# Altium schematic sheet Audio.SchDoc
size A3; SheetNumber: 2; SheetTotal: 6
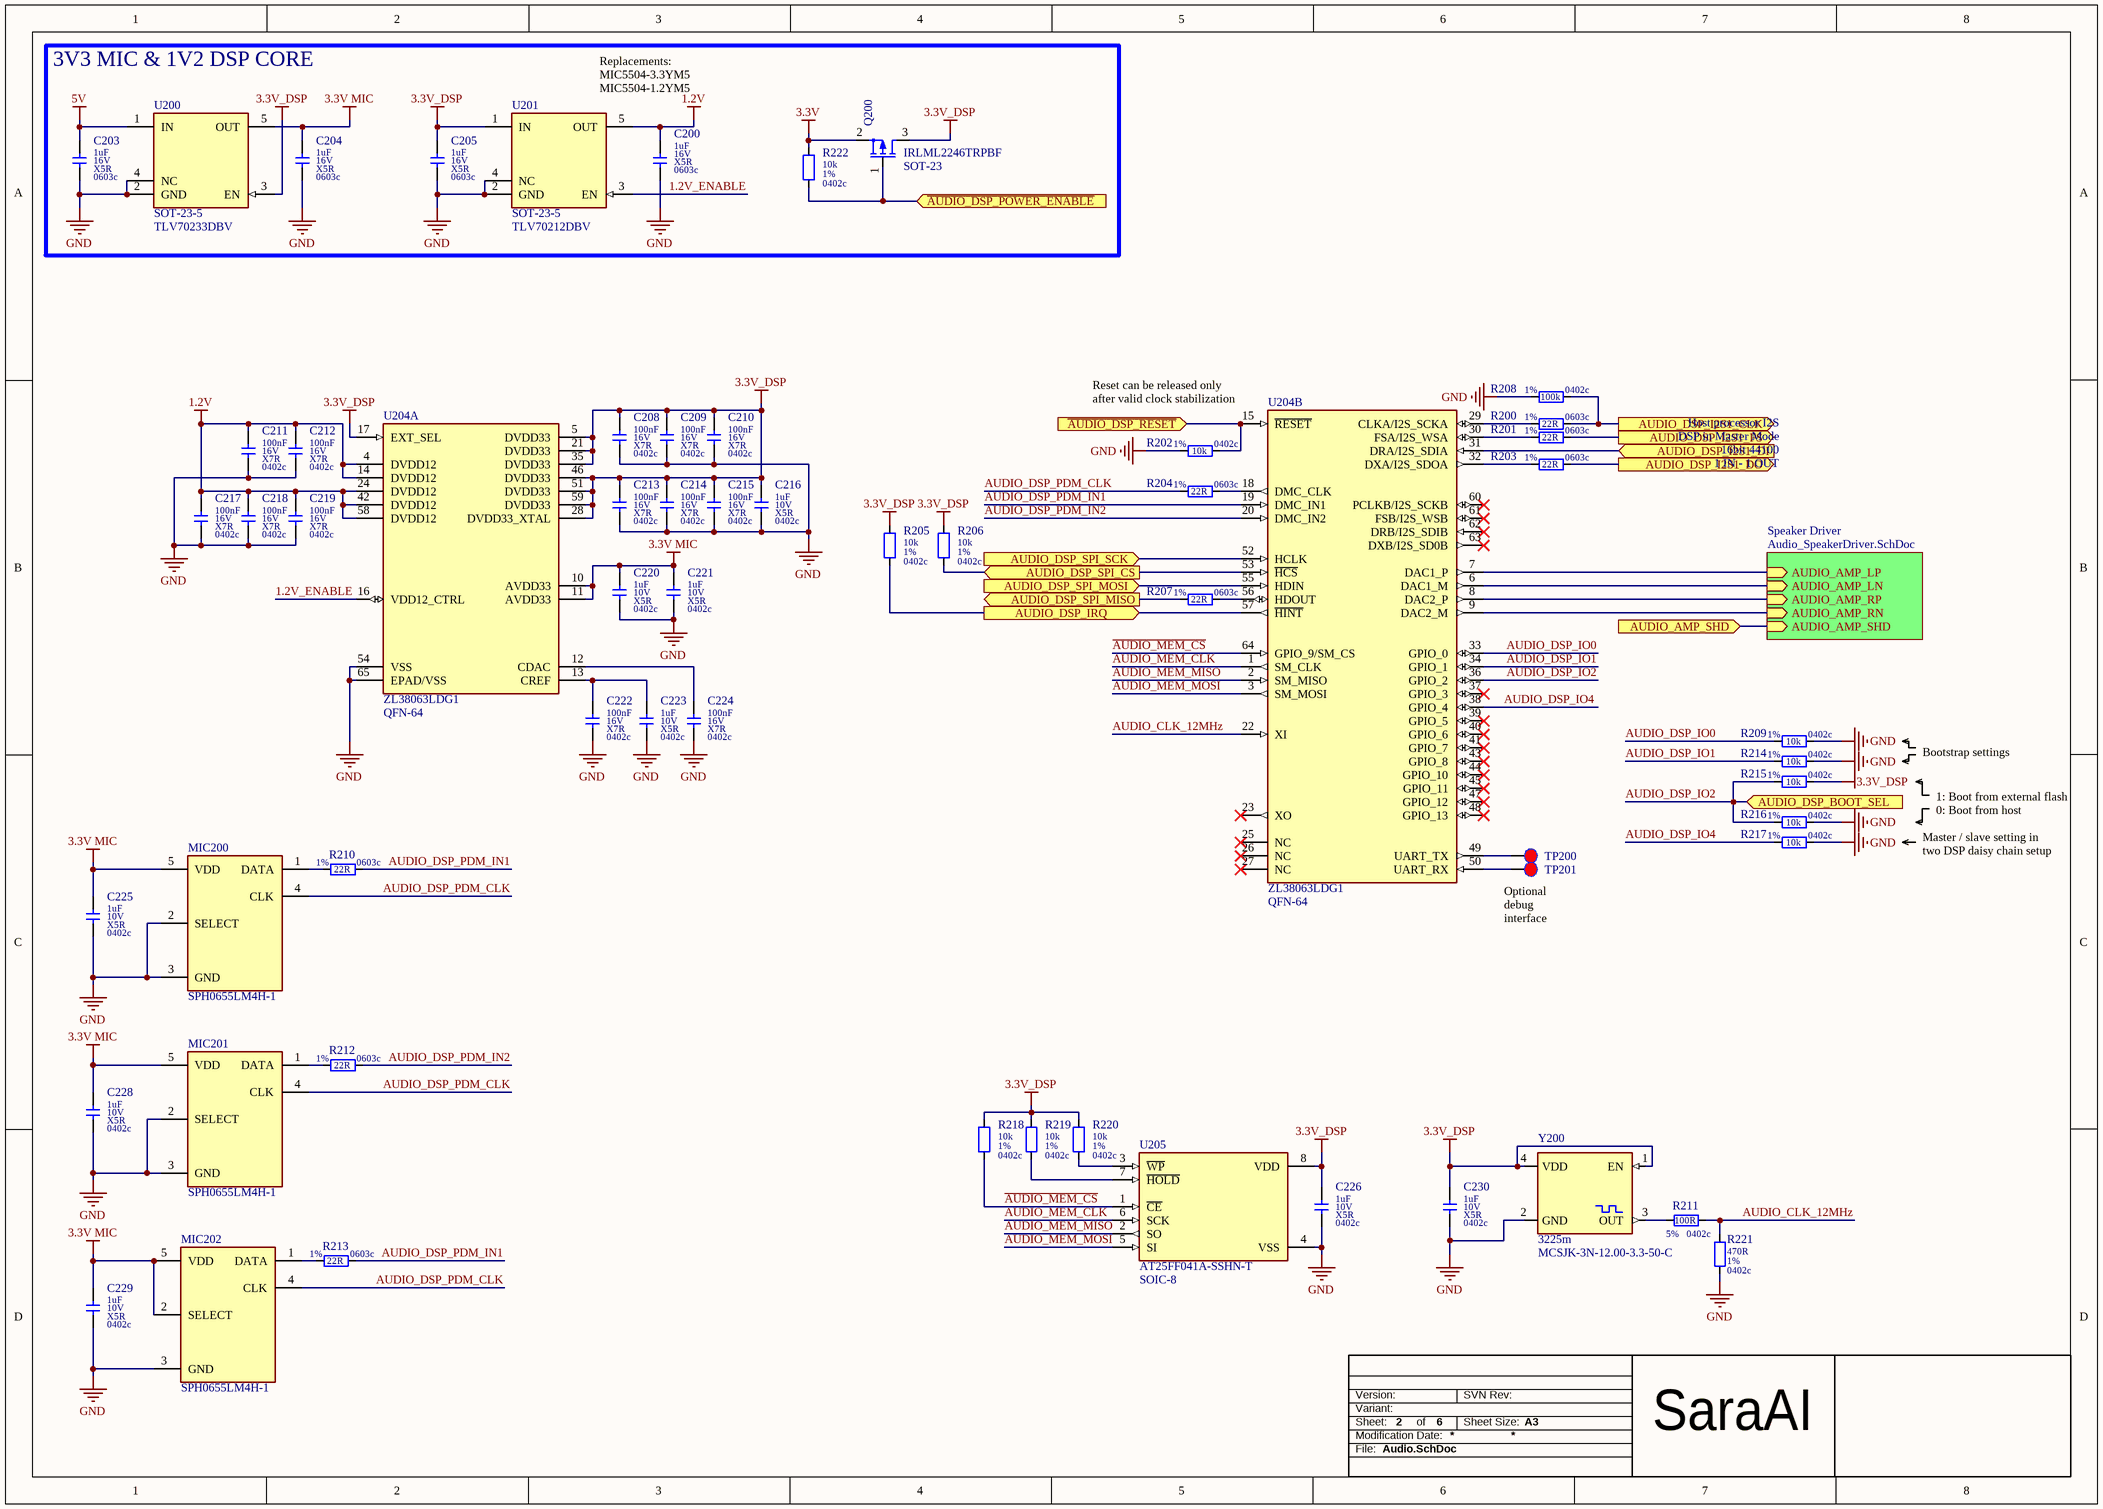
[diagram p0: Audio.SchDoc]

## Parts
C200  11 Parameter 4: X5R  07 Package: 0603c  08 Parameter 1: 1uF  09 Parameter 2: 16V  [CAPC1608X90L]  (hidden comment: CL10A105KO8NNNC)
C203  11 Parameter 4: X5R  07 Package: 0603c  08 Parameter 1: 1uF  09 Parameter 2: 16V  [CAPC1608X90L]  (hidden comment: CL10A105KO8NNNC)
C204  11 Parameter 4: X5R  07 Package: 0603c  08 Parameter 1: 1uF  09 Parameter 2: 16V  [CAPC1608X90L]  (hidden comment: CL10A105KO8NNNC)
C205  11 Parameter 4: X5R  07 Package: 0603c  08 Parameter 1: 1uF  09 Parameter 2: 16V  [CAPC1608X90L]  (hidden comment: CL10A105KO8NNNC)
C208  11 Parameter 4: X7R  07 Package: 0402c  08 Parameter 1: 100nF  09 Parameter 2: 16V  [CAPC1005X60L]  (hidden comment: CL05B104KO5NNNC)
C209  11 Parameter 4: X7R  07 Package: 0402c  08 Parameter 1: 100nF  09 Parameter 2: 16V  [CAPC1005X60L]  (hidden comment: CL05B104KO5NNNC)
C210  11 Parameter 4: X7R  07 Package: 0402c  08 Parameter 1: 100nF  09 Parameter 2: 16V  [CAPC1005X60L]  (hidden comment: CL05B104KO5NNNC)
C211  11 Parameter 4: X7R  07 Package: 0402c  08 Parameter 1: 100nF  09 Parameter 2: 16V  [CAPC1005X60L]  (hidden comment: CL05B104KO5NNNC)
C212  11 Parameter 4: X7R  07 Package: 0402c  08 Parameter 1: 100nF  09 Parameter 2: 16V  [CAPC1005X60L]  (hidden comment: CL05B104KO5NNNC)
C213  11 Parameter 4: X7R  07 Package: 0402c  08 Parameter 1: 100nF  09 Parameter 2: 16V  [CAPC1005X60L]  (hidden comment: CL05B104KO5NNNC)
C214  11 Parameter 4: X7R  07 Package: 0402c  08 Parameter 1: 100nF  09 Parameter 2: 16V  [CAPC1005X60L]  (hidden comment: CL05B104KO5NNNC)
C215  11 Parameter 4: X7R  07 Package: 0402c  08 Parameter 1: 100nF  09 Parameter 2: 16V  [CAPC1005X60L]  (hidden comment: CL05B104KO5NNNC)
C216  11 Parameter 4: X5R  07 Package: 0402c  08 Parameter 1: 1uF  09 Parameter 2: 10V  [CAPC1005X60L]  (hidden comment: CL05A105KP5NNNC)
C217  11 Parameter 4: X7R  07 Package: 0402c  08 Parameter 1: 100nF  09 Parameter 2: 16V  [CAPC1005X60L]  (hidden comment: CL05B104KO5NNNC)
C218  11 Parameter 4: X7R  07 Package: 0402c  08 Parameter 1: 100nF  09 Parameter 2: 16V  [CAPC1005X60L]  (hidden comment: CL05B104KO5NNNC)
C219  11 Parameter 4: X7R  07 Package: 0402c  08 Parameter 1: 100nF  09 Parameter 2: 16V  [CAPC1005X60L]  (hidden comment: CL05B104KO5NNNC)
C220  11 Parameter 4: X5R  07 Package: 0402c  08 Parameter 1: 1uF  09 Parameter 2: 10V  [CAPC1005X60L]  (hidden comment: CL05A105KP5NNNC)
C221  11 Parameter 4: X5R  07 Package: 0402c  08 Parameter 1: 1uF  09 Parameter 2: 10V  [CAPC1005X60L]  (hidden comment: CL05A105KP5NNNC)
C222  11 Parameter 4: X7R  07 Package: 0402c  08 Parameter 1: 100nF  09 Parameter 2: 16V  [CAPC1005X60L]  (hidden comment: CL05B104KO5NNNC)
C223  11 Parameter 4: X5R  07 Package: 0402c  08 Parameter 1: 1uF  09 Parameter 2: 10V  [CAPC1005X60L]  (hidden comment: CL05A105KP5NNNC)
C224  11 Parameter 4: X7R  07 Package: 0402c  08 Parameter 1: 100nF  09 Parameter 2: 16V  [CAPC1005X60L]  (hidden comment: CL05B104KO5NNNC)
C225  11 Parameter 4: X5R  07 Package: 0402c  08 Parameter 1: 1uF  09 Parameter 2: 10V  [CAPC1005X60L]  (hidden comment: CL05A105KP5NNNC)
C226  11 Parameter 4: X5R  07 Package: 0402c  08 Parameter 1: 1uF  09 Parameter 2: 10V  [CAPC1005X60L]  (hidden comment: CL05A105KP5NNNC)
C228  11 Parameter 4: X5R  07 Package: 0402c  08 Parameter 1: 1uF  09 Parameter 2: 10V  [CAPC1005X60L]  (hidden comment: CL05A105KP5NNNC)
C229  11 Parameter 4: X5R  07 Package: 0402c  08 Parameter 1: 1uF  09 Parameter 2: 10V  [CAPC1005X60L]  (hidden comment: CL05A105KP5NNNC)
C230  11 Parameter 4: X5R  07 Package: 0402c  08 Parameter 1: 1uF  09 Parameter 2: 10V  [CAPC1005X60L]  (hidden comment: CL05A105KP5NNNC)
MIC200  SPH0655LM4H-1  [KNOWLES SPH0655LM4H-1]
MIC201  SPH0655LM4H-1  [KNOWLES SPH0655LM4H-1]
MIC202  SPH0655LM4H-1  [KNOWLES SPH0655LM4H-1]
Q200  07 Package: SOT-23  [SOT95P240X110-3L]  (hidden comment: IRLML2246TRPBF)
R200  07 Package: 0603c  09 Parameter 2: 1%  08 Parameter 1: 22R  [RESC1608X55L]  (hidden comment: RC0603FR-0722RL)
R201  07 Package: 0603c  09 Parameter 2: 1%  08 Parameter 1: 22R  [RESC1608X55L]  (hidden comment: RC0603FR-0722RL)
R202  07 Package: 0402c  09 Parameter 2: 1%  08 Parameter 1: 10k  [RESC1005X40L]  (hidden comment: RC0402FR-0710KL)
R203  07 Package: 0603c  09 Parameter 2: 1%  08 Parameter 1: 22R  [RESC1608X55L]  (hidden comment: RC0603FR-0722RL)
R204  07 Package: 0603c  09 Parameter 2: 1%  08 Parameter 1: 22R  [RESC1608X55L]  (hidden comment: RC0603FR-0722RL)
R205  07 Package: 0402c  09 Parameter 2: 1%  08 Parameter 1: 10k  [RESC1005X40L]  (hidden comment: RC0402FR-0710KL)
R206  07 Package: 0402c  09 Parameter 2: 1%  08 Parameter 1: 10k  [RESC1005X40L]  (hidden comment: RC0402FR-0710KL)
R207  07 Package: 0603c  09 Parameter 2: 1%  08 Parameter 1: 22R  [RESC1608X55L]  (hidden comment: RC0603FR-0722RL)
R208  07 Package: 0402c  09 Parameter 2: 1%  08 Parameter 1: 100k  [RESC1005X40L]  (hidden comment: RC0402FR-07100KL)
R209  07 Package: 0402c  09 Parameter 2: 1%  08 Parameter 1: 10k  [RESC1005X40L]  (hidden comment: RC0402FR-0710KL)
R210  07 Package: 0603c  09 Parameter 2: 1%  08 Parameter 1: 22R  [RESC1608X55L]  (hidden comment: RC0603FR-0722RL)
R211  07 Package: 0402c  09 Parameter 2: 5%  08 Parameter 1: 100R  [RESC1005X40L]  (hidden comment: 0402WGJ0101TCE)
R212  07 Package: 0603c  09 Parameter 2: 1%  08 Parameter 1: 22R  [RESC1608X55L]  (hidden comment: RC0603FR-0722RL)
R213  07 Package: 0603c  09 Parameter 2: 1%  08 Parameter 1: 22R  [RESC1608X55L]  (hidden comment: RC0603FR-0722RL)
R214  07 Package: 0402c  09 Parameter 2: 1%  08 Parameter 1: 10k  [RESC1005X40L]  (hidden comment: RC0402FR-0710KL)
R215  07 Package: 0402c  09 Parameter 2: 1%  08 Parameter 1: 10k  [RESC1005X40L]  (hidden comment: RC0402FR-0710KL)
R216  07 Package: 0402c  09 Parameter 2: 1%  08 Parameter 1: 10k  [RESC1005X40L]  (hidden comment: RC0402FR-0710KL)
R217  07 Package: 0402c  09 Parameter 2: 1%  08 Parameter 1: 10k  [RESC1005X40L]  (hidden comment: RC0402FR-0710KL)
R218  07 Package: 0402c  09 Parameter 2: 1%  08 Parameter 1: 10k  [RESC1005X40L]  (hidden comment: RC0402FR-0710KL)
R219  07 Package: 0402c  09 Parameter 2: 1%  08 Parameter 1: 10k  [RESC1005X40L]  (hidden comment: RC0402FR-0710KL)
R220  07 Package: 0402c  09 Parameter 2: 1%  08 Parameter 1: 10k  [RESC1005X40L]  (hidden comment: RC0402FR-0710KL)
R221  07 Package: 0402c  09 Parameter 2: 1%  08 Parameter 1: 470R  [RESC1005X40L]  (hidden comment: RC0402FR-07470RL)
R222  07 Package: 0402c  09 Parameter 2: 1%  08 Parameter 1: 10k  [RESC1005X40L]  (hidden comment: RC0402FR-0710KL)
TP200  TESTPAD  [TP 1.2mm]  (value not drawn)  (no BOM)
TP201  TESTPAD  [TP 1.2mm]  (value not drawn)  (no BOM)
U200  07 Package: SOT-23-5  [SOT95P280X145-5L]  (hidden comment: TLV70233DBV)
U201  07 Package: SOT-23-5  [SOT95P280X145-5L]  (hidden comment: TLV70212DBV)
U204  07 Package: QFN-64  [QFN50P900X900X100_HS-65L]  (hidden comment: ZL38063LDG1)  (parts A,B of 2)
U205  07 Package: SOIC-8  [SOIC127P600X175-8L]  (hidden comment: AT25FF041A-SSHN-T)
Y200  07 Package: 3225m  [OSCCC320X250X100L]  (hidden comment: MCSJK-3N-12.00-3.3-50-C)

## Blocks framed on the sheet
3V3 MIC & 1V2 DSP CORE: C200 C203-C205 Q200 R222 U200 U201

## Sub-sheets
Speaker Driver = Audio_SpeakerDriver.SchDoc: AUDIO_AMP_LN (in), AUDIO_AMP_SHD (in), AUDIO_AMP_RN (in), AUDIO_AMP_RP (in), AUDIO_AMP_LP (in)

## Ports
AUDIO_AMP_SHD (in), AUDIO_DSP_BOOT_SEL (in), AUDIO_DSP_I2S1_CLK (out), AUDIO_DSP_I2S1_DI (in), AUDIO_DSP_I2S1_DO (out), AUDIO_DSP_I2S1_FS (out), AUDIO_DSP_IRQ (out), AUDIO_DSP_SPI_CS (in), AUDIO_DSP_SPI_MISO (out), AUDIO_DSP_SPI_MOSI (in), AUDIO_DSP_SPI_SCK (in), ~{AUDIO_DSP_POWER_ENABLE} (in), ~{AUDIO_DSP_RESET} (in)

## Nets
1.2V: C200.2 C211.2 C212.2 C217.2 C218.2 C219.2 U201.5(OUT) U204.4(DVDD12) U204.14(DVDD12) U204.24(DVDD12) U204.42(DVDD12) U204.58(DVDD12)
3.3V: Q200.2(S) R222.2
3.3V MIC: C204.2 C220.2 C221.2 C225.2 C228.2 C229.2 MIC200.5(VDD) MIC201.5(VDD) MIC202.2(SELECT) MIC202.5(VDD) U200.5(OUT) U204.10(AVDD33) U204.11(AVDD33)
3.3V_DSP: C205.2 C208.2 C209.2 C210.2 C213.2 C214.2 C215.2 C216.2 C226.2 C230.2 Q200.3(D) R205.2 R206.2 R215.2 R218.2 R219.2 R220.2 U200.3(EN) U201.1(IN) U204.5(DVDD33) U204.17(EXT_SEL) U204.21(DVDD33) U204.28(DVDD33_XTAL) U204.35(DVDD33) U204.46(DVDD33) U204.51(DVDD33) U204.59(DVDD33) U205.8(VDD) Y200.1(EN) Y200.4(VDD)
5V: C203.2 U200.1(IN)
GND: C200.1 C203.1 C204.1 C205.1 C208.1 C209.1 C210.1 C211.1 C212.1 C213.1 C214.1 C215.1 C216.1 C217.1 C218.1 C219.1 C220.1 C221.1 C222.1 C223.1 C224.1 C225.1 C226.1 C228.1 C229.1 C230.1 MIC200.2(SELECT) MIC200.3(GND) MIC201.2(SELECT) MIC201.3(GND) MIC202.3(GND) R202.1 R208.1 R209.2 R214.2 R216.2 R217.2 R221.1 U200.2(GND) U200.4(NC) U201.2(GND) U201.4(NC) U204.54(VSS) U204.65(EPAD/VSS) U205.4(VSS) Y200.2(GND)
1.2V_ENABLE: U201.3(EN) U204.16(VDD12_CTRL)
~{AUDIO_DSP_POWER_ENABLE}: Q200.1(G) R222.1 ; port ~{AUDIO_DSP_POWER_ENABLE}
~{AUDIO_DSP_RESET}: R202.2 U204.15(~{RESET}) ; port ~{AUDIO_DSP_RESET}
~{AUDIO_MEM_CS}: R218.1 U204.64(GPIO_9/SM_CS) U205.1(~{CE})
AUDIO_AMP_SHD: port AUDIO_AMP_SHD, sheet Speaker Driver/AUDIO_AMP_SHD
AUDIO_CLK_12MHz: R211.2 R221.2 U204.22(XI)
AUDIO_DSP_I2S1_CLK: R200.2 R208.2 ; port AUDIO_DSP_I2S1_CLK
AUDIO_DSP_I2S1_DI: U204.31(DRA/I2S_SDIA) ; port AUDIO_DSP_I2S1_DI
AUDIO_DSP_I2S1_DO: R203.2 ; port AUDIO_DSP_I2S1_DO
AUDIO_DSP_I2S1_FS: R201.2 ; port AUDIO_DSP_I2S1_FS
AUDIO_DSP_IO0: R209.1 U204.33(GPIO_0)
AUDIO_DSP_IO1: R214.1 U204.34(GPIO_1)
AUDIO_DSP_IO2: R215.1 R216.1 U204.36(GPIO_2) ; port AUDIO_DSP_BOOT_SEL
AUDIO_DSP_IO4: R217.1 U204.38(GPIO_4)
AUDIO_DSP_IRQ: R205.1 U204.57(~{HINT}) ; port AUDIO_DSP_IRQ
AUDIO_DSP_PDM_CLK: MIC200.4(CLK) MIC201.4(CLK) MIC202.4(CLK) R204.1
AUDIO_DSP_PDM_IN1: R210.2 R213.2 U204.19(DMC_IN1)
AUDIO_DSP_PDM_IN2: R212.2 U204.20(DMC_IN2)
AUDIO_DSP_SPI_CS: R206.1 U204.53(~{HCS}) ; port AUDIO_DSP_SPI_CS
AUDIO_DSP_SPI_MISO: R207.1 ; port AUDIO_DSP_SPI_MISO
AUDIO_DSP_SPI_MOSI: U204.55(HDIN) ; port AUDIO_DSP_SPI_MOSI
AUDIO_DSP_SPI_SCK: U204.52(HCLK) ; port AUDIO_DSP_SPI_SCK
AUDIO_MEM_CLK: U204.1(SM_CLK) U205.6(SCK)
AUDIO_MEM_MISO: U204.2(SM_MISO) U205.2(SO)
AUDIO_MEM_MOSI: U204.3(SM_MOSI) U205.5(SI)
NetC222_2: C222.2 C223.2 U204.13(CREF)
NetC224_2: C224.2 U204.12(CDAC)
NetMIC200_1: MIC200.1(DATA) R210.1
NetMIC201_1: MIC201.1(DATA) R212.1
NetMIC202_1: MIC202.1(DATA) R213.1
NetR200_1: R200.1 U204.29(CLKA/I2S_SCKA)
NetR201_1: R201.1 U204.30(FSA/I2S_WSA)
NetR203_1: R203.1 U204.32(DXA/I2S_SDOA)
NetR204_2: R204.2 U204.18(DMC_CLK)
NetR207_2: R207.2 U204.56(HDOUT)
NetR211_1: R211.1 Y200.3(OUT)
NetR219_1: R219.1 U205.7(~{HOLD})
NetR220_1: R220.1 U205.3(~{WP})
NetTP200_1: TP200.1 U204.49(UART_TX)
NetTP201_1: TP201.1 U204.50(UART_RX)
NetU204_6: U204.6(DAC1_M) ; sheet Speaker Driver/AUDIO_AMP_LN
NetU204_7: U204.7(DAC1_P) ; sheet Speaker Driver/AUDIO_AMP_LP
NetU204_8: U204.8(DAC2_P) ; sheet Speaker Driver/AUDIO_AMP_RP
NetU204_9: U204.9(DAC2_M) ; sheet Speaker Driver/AUDIO_AMP_RN

Not connected (* = marked no-connect by the designer): U204 23(XO)* 25(NC)* 26(NC)* 27(NC)* 37(GPIO_3)* 39(GPIO_5)* 40(GPIO_6)* 41(GPIO_7)* 43(GPIO_8)* 44(GPIO_10)* 45(GPIO_11)* 47(GPIO_12)* 48(GPIO_13)* 60(PCLKB/I2S_SCKB)* 61(FSB/I2S_WSB)* 62(DRB/I2S_SDIB)* 63(DXB/I2S_SD0B)*

## Notes on the sheet
- (near U201) Replacements: MIC5504-3.3YM5 MIC5504-1.2YM5
- Reset can be released only after valid clock stabilization
- Host processor I2S
- 16bit 44100
- DSP in Master Mode
- 1 IN - 1 OUT
- Bootstrap settings
- Master / slave setting in two DSP daisy chain setup
- 1: Boot from external flash
  0: Boot from host
- (near TP201) Optional debug interface
- Version:
- SVN Rev:
- Sheet:
- File:
- Modification Date:
- Variant:
- of
- Sheet Size:
- A3
- SaraAI

## Library data of the parts
C200 C203-C205 = 24: SMT 0603c 1uF 16V 10% X5R 6.9MHz 85'C; 03 Manufacturer: Samsung; 00 Index: 24; 01 Name: CAPACITOR CERAMIC CL10A105KO8NNNC Samsung; 05 Sub Group: CERAMIC; 04 Main Group: CAPACITOR; 06 Assembly: SMT; 12 Parameter 5: 6.9MHz; 13 Parameter 6: 85'C; 14 Modification Date: 16.11.2020; ComponentLink1Description: DATASHEET; ComponentLink1URL: E:\Praca\Mindsailors\Mindsailors Altium\Database Library\Datasheets\CAPACITOR\Samsung CL10A105KO8NNNC.pdf; 02 MPN: CL10A105KO8NNNC; 10 Parameter 3: 10%
C208-C215 C217-C219 C222 C224 = 138: SMT 0402c 100nF 16V 10% X7R 25.8MHz 125'C; 03 Manufacturer: Samsung; 00 Index: 138; 01 Name: CAPACITOR CERAMIC CL05B104KO5NNNC Samsung; 05 Sub Group: CERAMIC; 04 Main Group: CAPACITOR; 06 Assembly: SMT; 12 Parameter 5: 25.8MHz; 13 Parameter 6: 125'C; 14 Modification Date: 16.11.2020; ComponentLink1Description: DATASHEET; ComponentLink1URL: E:\Praca\Mindsailors\Mindsailors Altium\Database Library\Datasheets\CAPACITOR\Samsung CL05B104KO5NNNC.pdf; 02 MPN: CL05B104KO5NNNC; 10 Parameter 3: 10%
C216 C220 C221 C223 C225 C226 C228-C230 = 154: SMT 0402c 1uF 10V 10% X5R 10.2MHz 85'C; 03 Manufacturer: Samsung; 00 Index: 154; 01 Name: CAPACITOR THICK FILM CL05A105KP5NNNC Samsung; 05 Sub Group: THICK FILM; 04 Main Group: CAPACITOR; 06 Assembly: SMT; 12 Parameter 5: 10.2MHz; 13 Parameter 6: 85'C; 14 Modification Date: 16.11.2020; ComponentLink1Description: DATASHEET; ComponentLink1URL: E:\Praca\Mindsailors\Mindsailors Altium\Database Library\Datasheets\CAPACITOR\Samsung CL05A105KP5NNNC.pdf; 02 MPN: CL05A105KP5NNNC; 10 Parameter 3: 10%
MIC200-MIC202 = 494: SMT -37dBFS 1.65V - 3.6V 25Hz - 22kHz Omnidirectional; 03 Manufacturer: Knowles; 00 Index: 494; 01 Name: ACOUSTIC MICROPHONE SPH0655LM4H-1 Knowles; 04 Main Group: ACOUSTIC; 05 Sub Group: MICROPHONE; 06 Assembly: SMT; 11 Parameter 4: 25Hz - 22kHz; 13 Parameter 6: Omnidirectional; 14 Modification Date: 08.03.2021; ComponentLink1Description: DATASHEET; ComponentLink1URL: https://www.knowles.com/docs/default-source/default-document-library/sph0655lm4h-1_cornell_ii_datasheet_1.pdf?Status=Master&sfvrsn=663271b1_0; 09 Parameter 2: -37dBFS; 10 Parameter 3: 1.65V - 3.6V; 02 MPN: SPH0655LM4H-1; 07 Package: *
Q200 = 42: SMT SOT-23 P-MOS -20V -2.6A 1.3W; 03 Manufacturer: International Rectifier; 00 Index: 42; 01 Name: TRANSISTOR MOSFET IRLML2246TRPBF International Rectifier; 04 Main Group: TRANSISTOR; 05 Sub Group: MOSFET; Library Directory: sym_basics/; Fotprint Directory: fot_ipc/; 06 Assembly: SMT; 13 Parameter 6: 1.3W; 14 Modification Date: 16.11.2020; ComponentLink1Description: DATASHEET; ComponentLink1URL: E:\Praca\Mindsailors\Mindsailors Altium\Database Library\Datasheets\TRANSISTOR\International Rectifier IRLML2246TRPBF.pdf; 08 Parameter 1: P-MOS; 11 Parameter 4: -20V; 12 Parameter 5: -2.6A; 02 MPN: IRLML2246TRPBF
R200 R201 R203 R204 R207 R210 R212 R213 = 318: SMT 0603c 22R 1% 100mW 100ppm/K 75V; 03 Manufacturer: Yageo; 00 Index: 318; 01 Name: RESISTOR THICK FILM RC0603FR-0722RL Yageo; 05 Sub Group: THICK FILM; Library Directory: sym_basics/; Fotprint Directory: fot_ipc/; 04 Main Group: RESISTOR; 06 Assembly: SMT; 11 Parameter 4: 100ppm/K; 12 Parameter 5: 75V; 14 Modification Date: 25.01.2021; ComponentLink1Description: DATASHEET; ComponentLink1URL: https://www.yageo.com/upload/media/product/products/datasheet/rchip/PYu-RC_Group_51_RoHS_L_11.pdf; 10 Parameter 3: 100mW; 02 MPN: RC0603FR-0722RL
R202 R209 R214-R217 = 15: SMT 0402c 10k 1% 62.5mW 100ppm/K 50V; 03 Manufacturer: Yageo; 00 Index: 15; 01 Name: RESISTOR THICK FILM RC0402FR-0710KL Yageo; 05 Sub Group: THICK FILM; Library Directory: sym_basics/; Fotprint Directory: fot_ipc/; 04 Main Group: RESISTOR; 06 Assembly: SMT; 11 Parameter 4: 100ppm/K; 12 Parameter 5: 50V; 14 Modification Date: 16.11.2020; ComponentLink1Description: DATASHEET; ComponentLink1URL: E:\Praca\Mindsailors\Mindsailors Altium\Database Library\Datasheets\RESISTOR\Yageo RC_L Series.pdf; 10 Parameter 3: 62.5mW; 02 MPN: RC0402FR-0710KL
R205 R206 R218-R220 R222 = 15: SMT 0402c 10k 1% 62.5mW 100ppm/K 50V; 03 Manufacturer: Yageo; 00 Index: 15; 01 Name: RESISTOR THICK FILM RC0402FR-0710KL Yageo; 05 Sub Group: THICK FILM; 04 Main Group: RESISTOR; 06 Assembly: SMT; 11 Parameter 4: 100ppm/K; 12 Parameter 5: 50V; 14 Modification Date: 16.11.2020; ComponentLink1Description: DATASHEET; ComponentLink1URL: E:\Praca\Mindsailors\Mindsailors Altium\Database Library\Datasheets\RESISTOR\Yageo RC_L Series.pdf; 10 Parameter 3: 62.5mW; 02 MPN: RC0402FR-0710KL
R208 = 18: SMT 0402c 100k 1% 62.5mW 100ppm/K 50V; 03 Manufacturer: Yageo; 00 Index: 18; 01 Name: RESISTOR THICK FILM RC0402FR-07100KL Yageo; 05 Sub Group: THICK FILM; Library Directory: sym_basics/; Fotprint Directory: fot_ipc/; 04 Main Group: RESISTOR; 06 Assembly: SMT; 11 Parameter 4: 100ppm/K; 12 Parameter 5: 50V; 14 Modification Date: 16.11.2020; ComponentLink1Description: DATASHEET; ComponentLink1URL: E:\Praca\Mindsailors\Mindsailors Altium\Database Library\Datasheets\RESISTOR\Yageo RC_L Series.pdf; 10 Parameter 3: 62.5mW; 02 MPN: RC0402FR-07100KL
R211 = 129: SMT 0402c 100R 5% 62.5mW 200ppm/K 50V; 03 Manufacturer: Royal Ohm; 00 Index: 129; 01 Name: RESISTOR THICK FILM 0402WGJ0101TCE Royal Ohm; 05 Sub Group: THICK FILM; Library Directory: sym_basics/; Fotprint Directory: fot_ipc/; 04 Main Group: RESISTOR; 06 Assembly: SMT; 11 Parameter 4: 200ppm/K; 12 Parameter 5: 50V; 14 Modification Date: 16.11.2020; ComponentLink1Description: DATASHEET; ComponentLink1URL: E:\Praca\Mindsailors\Mindsailors Altium\Database Library\Datasheets\RESISTOR\ROYAL OHM Thick Film Chip Resistors.pdf; 10 Parameter 3: 62.5mW; 02 MPN: 0402WGJ0101TCE
R221 = 21: SMT 0402c 470R 1% 62.5mW 100ppm/K 50V; 03 Manufacturer: Yageo; 00 Index: 21; 01 Name: RESISTOR THICK FILM RC0402FR-07470RL Yageo; 05 Sub Group: THICK FILM; Library Directory: sym_basics/; Fotprint Directory: fot_ipc/; 04 Main Group: RESISTOR; 06 Assembly: SMT; 11 Parameter 4: 100ppm/K; 12 Parameter 5: 50V; 14 Modification Date: 16.11.2020; ComponentLink1Description: DATASHEET; ComponentLink1URL: E:\Praca\Mindsailors\Mindsailors Altium\Database Library\Datasheets\RESISTOR\Yageo RC_L Series.pdf; 10 Parameter 3: 62.5mW; 02 MPN: RC0402FR-07470RL
TP200 TP201 = 10: 00 Index: 10; 01 Name: PCB COMPONENT TESTPAD TESTPAD; 04 Main Group: PCB COMPONENT; 02 MPN: TESTPAD; 05 Sub Group: TESTPAD; 14 Modification Date: 16.11.2020
U200 = 479: SMT SOT-23-5 3.3V 5.5V 300mA 375mV; 03 Manufacturer: Texas Instruments; 00 Index: 479; 01 Name: IC VOLTAGE REGULATOR TLV70233DBV Texas Instruments; 04 Main Group: IC; 05 Sub Group: VOLTAGE REGULATOR; 06 Assembly: SMT; 11 Parameter 4: 5.5V; 12 Parameter 5: 300mA; 13 Parameter 6: 375mV; 14 Modification Date: 21.02.2021; ComponentLink1Description: DATASHEET; ComponentLink1URL: https://www.ti.com/lit/ds/symlink/tlv702.pdf?ts=1613945518536&ref_url=https%253A%252F%252Fwww.google.com%252F; 08 Parameter 1: 3.3V; 02 MPN: TLV70233DBV
U201 = 474: SMT SOT-23-5 1.2V 5.5V 300mA 375mV; 03 Manufacturer: Texas Instruments; 00 Index: 474; 01 Name: IC VOLTAGE REGULATOR TLV70212DBV Texas Instruments; 04 Main Group: IC; 05 Sub Group: VOLTAGE REGULATOR; Library Directory: sym_other/; Fotprint Directory: fot_ipc/; 06 Assembly: SMT; 11 Parameter 4: 5.5V; 12 Parameter 5: 300mA; 13 Parameter 6: 375mV; 14 Modification Date: 21.02.2021; ComponentLink1Description: DATASHEET; ComponentLink1URL: https://www.ti.com/lit/ds/symlink/tlv702.pdf?ts=1613945518536&ref_url=https%253A%252F%252Fwww.google.com%252F; 08 Parameter 1: 1.2V; 02 MPN: TLV70212DBV
U204 = 545: SMT QFN-64 Audio DSP and DAC; 03 Manufacturer: Microchip; 00 Index: 545; 01 Name: IC PROCESSOR ZL38063LDG1  Microchip; 04 Main Group: IC; 05 Sub Group: PROCESSOR; Library Directory: sym_other/; Fotprint Directory: fot_ipc/; 06 Assembly: SMT; 11 Parameter 4: Audio DSP and DAC; 14 Modification Date: 06.05.2021; ComponentLink1Description: DATASHEET; ComponentLink1URL: https://www.google.com/url?sa=t&rct=j&q=&esrc=s&source=web&cd=&ved=2ahUKEwijw8HIxrTwAhWvxIsKHU2NBBgQFjABegQIAhAD&url=https%3A%2F%2Fwww.microsemi.com%2Fdocument-portal%2Fdoc_download%2F136798-zl38063-datasheet&usg=AOvVaw2eoUfxAubW_M5spPpwFKjp; 02 MPN: ZL38063LDG1
U205 = 751: SMT SOIC-8 Flash 4Mbit 1.65V - 3.6V SPI; 03 Manufacturer: Adesto; 00 Index: 751; 01 Name: IC MEMORY / AT25FF041A-SSHN-T Adesto; 04 Main Group: IC; 05 Sub Group: MEMORY; Library Directory: sym_other/; Fotprint Directory: fot_ipc/; 06 Assembly: SMT; 11 Parameter 4: 1.65V - 3.6V; 12 Parameter 5: SPI; 14 Modification Date: 02.09.2021; ComponentLink1Description: DATASHEET; ComponentLink1URL: https://pl.mouser.com/datasheet/2/590/at25ff041a-2487492.pdf; 09 Parameter 2: 4Mbit; 08 Parameter 1: Flash; 02 MPN: AT25FF041A-SSHN-T
Y200 = 471: SMT 3225m 12MHz 50ppm; 03 Manufacturer: Multicomp; 00 Index: 471; 01 Name: OSCILLATOR XO MCSJK-3N-12.00-3.3-50-C Multicomp; 05 Sub Group: XO; Library Directory: sym_basics/; Fotprint Directory: fot_ipc/; 04 Main Group: OSCILLATOR; 06 Assembly: SMT; 11 Parameter 4: 50ppm; 14 Modification Date: 19.02.2021; ComponentLink1Description: DATASHEET; ComponentLink1URL: http://www.farnell.com/datasheets/2864171.pdf; 08 Parameter 1: 12MHz; 02 MPN: MCSJK-3N-12.00-3.3-50-C